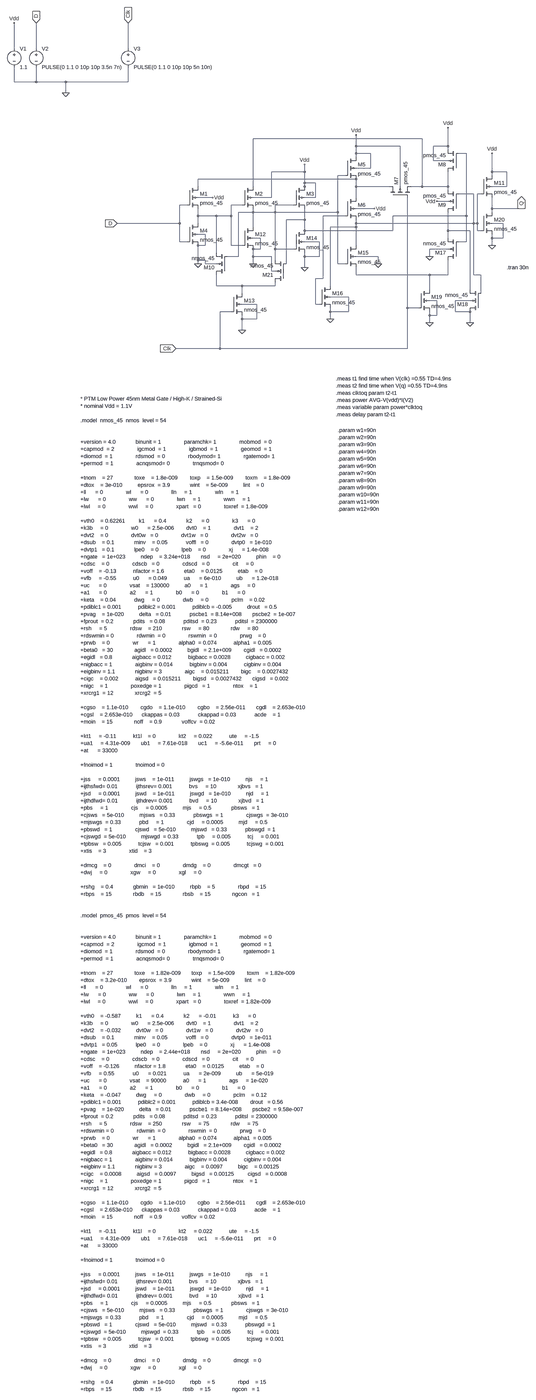
[diagram p0: schematic TCFF.asc, whole sheet]
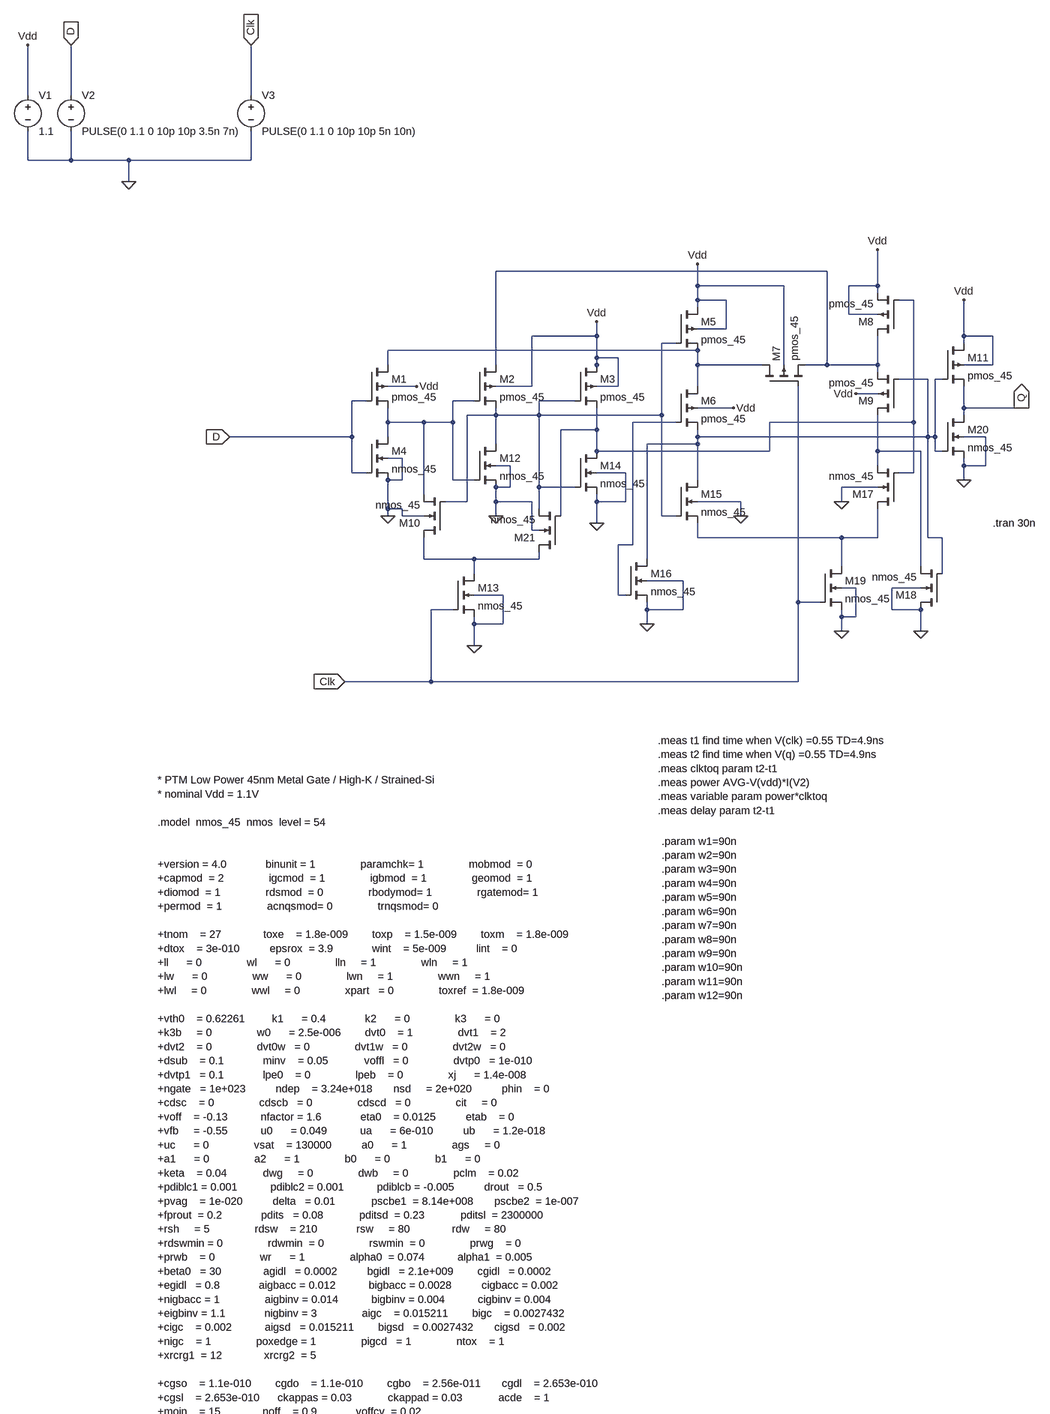
[diagram p1: schematic TCFF.asc, part, row 1 of 2, column 1 of 1]
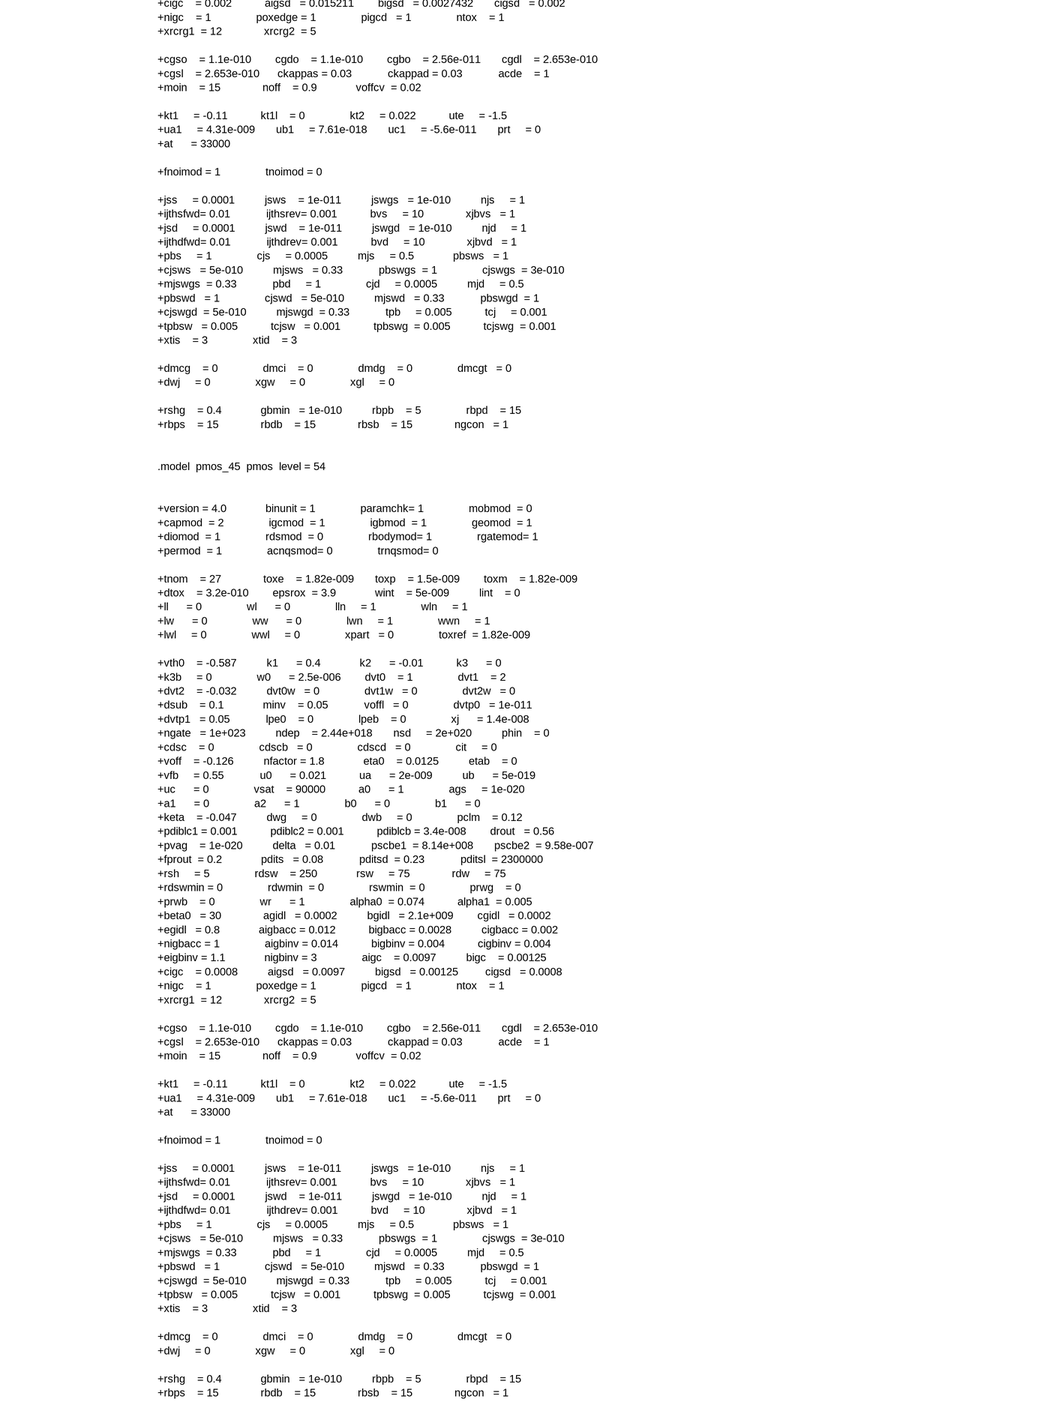
[diagram p2: schematic TCFF.asc, part, row 2 of 2, column 1 of 1]
TCFF.asc, the LTspice schematic file:
Version 4
SHEET 1 1628 4944
WIRE -656 -768 -656 -880
WIRE -560 -768 -560 -880
WIRE -160 -768 -160 -880
WIRE -656 -624 -656 -688
WIRE -560 -624 -560 -688
WIRE -560 -624 -656 -624
WIRE -432 -624 -560 -624
WIRE -160 -624 -160 -688
WIRE -160 -624 -432 -624
WIRE -432 -576 -432 -624
WIRE 1120 -112 384 -112
WIRE 832 -80 832 -128
WIRE 1024 -80 832 -80
WIRE 1232 -80 1232 -160
WIRE 1232 -80 1168 -80
WIRE 1232 -64 1232 -80
WIRE 832 -48 832 -80
WIRE 896 -48 832 -48
WIRE 1312 -48 1280 -48
WIRE 832 -32 832 -48
WIRE 1168 -16 1168 -80
WIRE 1232 -16 1168 -16
WIRE 896 16 896 -48
WIRE 896 16 832 16
WIRE 608 32 608 0
WIRE 608 32 464 32
WIRE 1424 32 1424 -48
WIRE 1488 32 1424 32
WIRE 784 48 752 48
WIRE 1424 48 1424 32
WIRE 832 64 144 64
WIRE 608 80 608 32
WIRE 656 80 608 80
WIRE 144 96 144 64
WIRE 384 96 384 -112
WIRE 608 96 608 80
WIRE 832 96 832 64
WIRE 976 96 832 96
WIRE 1024 96 1024 -80
WIRE 1120 96 1120 -112
WIRE 1120 96 1072 96
WIRE 1232 96 1232 32
WIRE 1232 96 1120 96
WIRE 1488 96 1488 32
WIRE 1488 96 1424 96
WIRE 608 112 608 96
WIRE 1232 112 1232 96
WIRE 1344 128 1280 128
WIRE 1376 128 1360 128
WIRE 208 144 144 144
WIRE 464 144 464 32
WIRE 464 144 384 144
WIRE 656 144 656 80
WIRE 656 144 608 144
WIRE 832 144 832 96
WIRE 1232 160 1184 160
WIRE 96 176 64 176
WIRE 336 176 288 176
WIRE 560 176 480 176
WIRE 912 192 832 192
WIRE 1424 192 1424 144
WIRE 1552 192 1424 192
WIRE 1568 192 1552 192
WIRE 384 208 384 192
WIRE 384 208 320 208
WIRE 480 208 480 176
WIRE 480 208 384 208
WIRE 752 208 752 48
WIRE 752 208 480 208
WIRE 1424 208 1424 192
WIRE 144 224 144 192
WIRE 224 224 144 224
WIRE 288 224 288 176
WIRE 288 224 224 224
WIRE 784 224 688 224
WIRE 1312 224 1312 -48
WIRE 1312 224 992 224
WIRE 608 240 608 192
WIRE 608 240 528 240
WIRE 64 256 64 176
WIRE 64 256 -208 256
WIRE 144 256 144 224
WIRE 832 256 832 240
WIRE 1344 256 1344 128
WIRE 1344 256 832 256
WIRE 1360 256 1360 128
WIRE 1360 256 1344 256
WIRE 1472 256 1424 256
WIRE 384 272 384 208
WIRE 832 272 832 256
WIRE 832 272 720 272
WIRE 608 288 608 240
WIRE 992 288 992 224
WIRE 992 288 608 288
WIRE 1232 288 1232 208
WIRE 1328 288 1232 288
WIRE 1360 288 1360 256
WIRE 1376 288 1360 288
WIRE 176 304 144 304
WIRE 416 320 384 320
WIRE 1232 320 1232 288
WIRE 1424 320 1424 304
WIRE 1472 320 1472 256
WIRE 1472 320 1424 320
WIRE 64 336 64 256
WIRE 96 336 64 336
WIRE 672 336 608 336
WIRE 1312 336 1312 224
WIRE 1312 336 1280 336
WIRE 176 352 176 304
WIRE 176 352 144 352
WIRE 288 352 288 224
WIRE 336 352 288 352
WIRE 832 352 832 272
WIRE 1424 352 1424 320
WIRE 416 368 416 320
WIRE 416 368 384 368
WIRE 480 368 480 208
WIRE 560 368 480 368
WIRE 1232 368 1152 368
WIRE 224 384 224 224
WIRE 320 400 320 208
WIRE 320 400 272 400
WIRE 384 400 384 368
WIRE 464 400 384 400
WIRE 608 400 608 384
WIRE 672 400 672 336
WIRE 672 400 608 400
WIRE 928 400 832 400
WIRE 1152 400 1152 368
WIRE 144 416 144 352
WIRE 176 416 144 416
WIRE 480 416 480 368
WIRE 144 432 144 416
WIRE 176 432 176 416
WIRE 224 432 176 432
WIRE 384 432 384 400
WIRE 528 432 528 240
WIRE 752 432 752 208
WIRE 784 432 752 432
WIRE 928 432 928 400
WIRE 608 448 608 400
WIRE 464 464 464 400
WIRE 480 464 464 464
WIRE 832 480 832 448
WIRE 1152 480 832 480
WIRE 1232 480 1232 416
WIRE 1232 480 1152 480
WIRE 1344 480 1344 256
WIRE 1376 480 1344 480
WIRE 688 496 688 224
WIRE 688 496 656 496
WIRE 224 528 224 480
WIRE 336 528 224 528
WIRE 480 528 480 512
WIRE 480 528 336 528
WIRE 720 528 720 272
WIRE 1152 544 1152 480
WIRE 1328 544 1328 288
WIRE 336 560 336 528
WIRE 1376 560 1376 480
WIRE 800 576 720 576
WIRE 1184 592 1152 592
WIRE 1328 592 1264 592
WIRE 400 608 336 608
WIRE 656 608 656 496
WIRE 672 608 656 608
WIRE 1056 624 1056 144
WIRE 1104 624 1056 624
WIRE 288 640 240 640
WIRE 720 640 720 624
WIRE 800 640 800 576
WIRE 800 640 720 640
WIRE 1264 640 1264 592
WIRE 1328 640 1264 640
WIRE 1152 656 1152 640
WIRE 1184 656 1184 592
WIRE 1184 656 1152 656
WIRE 336 672 336 656
WIRE 400 672 400 608
WIRE 400 672 336 672
WIRE 720 672 720 640
WIRE 1152 688 1152 656
WIRE 1328 688 1328 640
WIRE 336 720 336 672
WIRE 240 800 240 640
WIRE 240 800 48 800
WIRE 1056 800 1056 624
WIRE 1056 800 240 800
FLAG -560 -880 D
IOPIN -560 -880 In
FLAG -160 -880 Clk
IOPIN -160 -880 In
FLAG -656 -880 Vdd
FLAG -432 -576 0
FLAG 1424 352 0
FLAG 1328 688 0
FLAG 1152 688 0
FLAG 720 672 0
FLAG 336 720 0
FLAG 608 448 0
FLAG 384 432 0
FLAG 144 432 0
FLAG 48 800 Clk
IOPIN 48 800 In
FLAG -208 256 D
IOPIN -208 256 In
FLAG 608 0 Vdd
FLAG 832 -128 Vdd
FLAG 1232 -160 Vdd
FLAG 1424 -48 Vdd
FLAG 1184 160 Vdd
FLAG 1152 400 0
FLAG 208 144 Vdd
FLAG 912 192 Vdd
FLAG 928 432 0
FLAG 1552 192 Q
IOPIN 1552 192 Out
SYMBOL pmos4 96 96 R0
SYMATTR InstName M1
SYMATTR Value pmos_45
SYMATTR Value2 l=45n w=180n
SYMBOL pmos4 336 96 R0
SYMATTR InstName M2
SYMATTR Value pmos_45
SYMATTR Value2 l=45n w=180n
SYMBOL pmos4 560 96 R0
SYMATTR InstName M3
SYMATTR Value pmos_45
SYMATTR Value2 l=45n w=180n
SYMBOL pmos4 784 -32 R0
SYMATTR InstName M5
SYMATTR Value pmos_45
SYMATTR Value2 l=45n w=180n
SYMBOL pmos4 784 144 R0
SYMATTR InstName M6
SYMATTR Value pmos_45
SYMATTR Value2 l=45n w=180n
SYMBOL pmos4 976 144 R270
SYMATTR InstName M7
SYMATTR Value pmos_45
SYMATTR Value2 l=45n w=180n
SYMBOL pmos4 1280 32 R180
SYMATTR InstName M8
SYMATTR Value pmos_45
SYMATTR Value2 l=45n w=180n
SYMBOL pmos4 1280 208 R180
SYMATTR InstName M9
SYMATTR Value pmos_45
SYMATTR Value2 l=45n w=180n
SYMBOL pmos4 1376 48 R0
SYMATTR InstName M11
SYMATTR Value pmos_45
SYMATTR Value2 l=45n w=180n
SYMBOL nmos4 96 256 R0
SYMATTR InstName M4
SYMATTR Value nmos_45
SYMATTR Value2 l=45n w={w1}
SYMBOL nmos4 272 480 R180
SYMATTR InstName M10
SYMATTR Value nmos_45
SYMATTR Value2 l=45n w={w2}
SYMBOL nmos4 336 272 R0
SYMATTR InstName M12
SYMATTR Value nmos_45
SYMATTR Value2 l=45n w={w4}
SYMBOL nmos4 288 560 R0
SYMATTR InstName M13
SYMATTR Value nmos_45
SYMATTR Value2 l=45n w={w3}
SYMBOL nmos4 560 288 R0
SYMATTR InstName M14
SYMATTR Value nmos_45
SYMATTR Value2 l=45n w={w6}
SYMBOL nmos4 784 352 R0
SYMATTR InstName M15
SYMATTR Value nmos_45
SYMATTR Value2 l=45n w={w7}
SYMBOL nmos4 672 528 R0
SYMATTR InstName M16
SYMATTR Value nmos_45
SYMATTR Value2 l=45n w={w8}
SYMBOL nmos4 1280 416 R180
SYMATTR InstName M17
SYMATTR Value nmos_45
SYMATTR Value2 l=45n w={w9}
SYMBOL nmos4 1376 640 R180
SYMATTR InstName M18
SYMATTR Value nmos_45
SYMATTR Value2 l=45n w={w11}
SYMBOL nmos4 1104 544 R0
SYMATTR InstName M19
SYMATTR Value nmos_45
SYMATTR Value2 l=45n w={w10}
SYMBOL nmos4 1376 208 R0
SYMATTR InstName M20
SYMATTR Value nmos_45
SYMATTR Value2 l=45n w={w12}
SYMBOL voltage -656 -784 R0
WINDOW 123 0 0 Left 0
WINDOW 39 0 0 Left 0
SYMATTR InstName V1
SYMATTR Value 1.1
SYMBOL voltage -560 -784 R0
WINDOW 123 0 0 Left 0
WINDOW 39 0 0 Left 0
SYMATTR InstName V2
SYMATTR Value PULSE(0 1.1 0 10p 10p 3.5n 7n)
SYMBOL voltage -160 -784 R0
WINDOW 123 0 0 Left 0
WINDOW 39 0 0 Left 0
SYMATTR InstName V3
SYMATTR Value PULSE(0 1.1 0 10p 10p 5n 10n)
SYMBOL nmos4 528 512 R180
SYMATTR InstName M21
SYMATTR Value nmos_45
SYMATTR Value2 l=45n w={w5}
TEXT 1488 448 Left 2 !.tran 30n
TEXT -368 1064 Left 2 !* PTM Low Power 45nm Metal Gate / High-K / Strained-Si\n* nominal Vdd = 1.1V\n \n.model  nmos_45  nmos  level = 54\n \n \n+version = 4.0             binunit = 1               paramchk= 1               mobmod  = 0             \n+capmod  = 2               igcmod  = 1               igbmod  = 1               geomod  = 1             \n+diomod  = 1               rdsmod  = 0               rbodymod= 1               rgatemod= 1             \n+permod  = 1               acnqsmod= 0               trnqsmod= 0             \n \n+tnom    = 27              toxe    = 1.8e-009        toxp    = 1.5e-009        toxm    = 1.8e-009      \n+dtox    = 3e-010          epsrox  = 3.9             wint    = 5e-009          lint    = 0             \n+ll      = 0               wl      = 0               lln     = 1               wln     = 1             \n+lw      = 0               ww      = 0               lwn     = 1               wwn     = 1             \n+lwl     = 0               wwl     = 0               xpart   = 0               toxref  = 1.8e-009      \n \n+vth0    = 0.62261         k1      = 0.4             k2      = 0               k3      = 0             \n+k3b     = 0               w0      = 2.5e-006        dvt0    = 1               dvt1    = 2             \n+dvt2    = 0               dvt0w   = 0               dvt1w   = 0               dvt2w   = 0             \n+dsub    = 0.1             minv    = 0.05            voffl   = 0               dvtp0   = 1e-010        \n+dvtp1   = 0.1             lpe0    = 0               lpeb    = 0               xj      = 1.4e-008      \n+ngate   = 1e+023          ndep    = 3.24e+018       nsd     = 2e+020          phin    = 0             \n+cdsc    = 0               cdscb   = 0               cdscd   = 0               cit     = 0             \n+voff    = -0.13           nfactor = 1.6             eta0    = 0.0125          etab    = 0             \n+vfb     = -0.55           u0      = 0.049           ua      = 6e-010          ub      = 1.2e-018      \n+uc      = 0               vsat    = 130000          a0      = 1               ags     = 0             \n+a1      = 0               a2      = 1               b0      = 0               b1      = 0             \n+keta    = 0.04            dwg     = 0               dwb     = 0               pclm    = 0.02          \n+pdiblc1 = 0.001           pdiblc2 = 0.001           pdiblcb = -0.005          drout   = 0.5           \n+pvag    = 1e-020          delta   = 0.01            pscbe1  = 8.14e+008       pscbe2  = 1e-007        \n+fprout  = 0.2             pdits   = 0.08            pditsd  = 0.23            pditsl  = 2300000       \n+rsh     = 5               rdsw    = 210             rsw     = 80              rdw     = 80            \n+rdswmin = 0               rdwmin  = 0               rswmin  = 0               prwg    = 0             \n+prwb    = 0               wr      = 1               alpha0  = 0.074           alpha1  = 0.005         \n+beta0   = 30              agidl   = 0.0002          bgidl   = 2.1e+009        cgidl   = 0.0002        \n+egidl   = 0.8             aigbacc = 0.012           bigbacc = 0.0028          cigbacc = 0.002         \n+nigbacc = 1               aigbinv = 0.014           bigbinv = 0.004           cigbinv = 0.004         \n+eigbinv = 1.1             nigbinv = 3               aigc    = 0.015211        bigc    = 0.0027432     \n+cigc    = 0.002           aigsd   = 0.015211        bigsd   = 0.0027432       cigsd   = 0.002         \n+nigc    = 1               poxedge = 1               pigcd   = 1               ntox    = 1             \n+xrcrg1  = 12              xrcrg2  = 5             \n \n+cgso    = 1.1e-010        cgdo    = 1.1e-010        cgbo    = 2.56e-011       cgdl    = 2.653e-010    \n+cgsl    = 2.653e-010      ckappas = 0.03            ckappad = 0.03            acde    = 1             \n+moin    = 15              noff    = 0.9             voffcv  = 0.02          \n \n+kt1     = -0.11           kt1l    = 0               kt2     = 0.022           ute     = -1.5          \n+ua1     = 4.31e-009       ub1     = 7.61e-018       uc1     = -5.6e-011       prt     = 0             \n+at      = 33000         \n \n+fnoimod = 1               tnoimod = 0             \n \n+jss     = 0.0001          jsws    = 1e-011          jswgs   = 1e-010          njs     = 1             \n+ijthsfwd= 0.01            ijthsrev= 0.001           bvs     = 10              xjbvs   = 1             \n+jsd     = 0.0001          jswd    = 1e-011          jswgd   = 1e-010          njd     = 1             \n+ijthdfwd= 0.01            ijthdrev= 0.001           bvd     = 10              xjbvd   = 1             \n+pbs     = 1               cjs     = 0.0005          mjs     = 0.5             pbsws   = 1             \n+cjsws   = 5e-010          mjsws   = 0.33            pbswgs  = 1               cjswgs  = 3e-010        \n+mjswgs  = 0.33            pbd     = 1               cjd     = 0.0005          mjd     = 0.5           \n+pbswd   = 1               cjswd   = 5e-010          mjswd   = 0.33            pbswgd  = 1             \n+cjswgd  = 5e-010          mjswgd  = 0.33            tpb     = 0.005           tcj     = 0.001         \n+tpbsw   = 0.005           tcjsw   = 0.001           tpbswg  = 0.005           tcjswg  = 0.001         \n+xtis    = 3               xtid    = 3             \n \n+dmcg    = 0               dmci    = 0               dmdg    = 0               dmcgt   = 0             \n+dwj     = 0               xgw     = 0               xgl     = 0             \n \n+rshg    = 0.4             gbmin   = 1e-010          rbpb    = 5               rbpd    = 15            \n+rbps    = 15              rbdb    = 15              rbsb    = 15              ngcon   = 1             \n \n \n.model  pmos_45  pmos  level = 54\n \n \n+version = 4.0             binunit = 1               paramchk= 1               mobmod  = 0             \n+capmod  = 2               igcmod  = 1               igbmod  = 1               geomod  = 1             \n+diomod  = 1               rdsmod  = 0               rbodymod= 1               rgatemod= 1             \n+permod  = 1               acnqsmod= 0               trnqsmod= 0             \n \n+tnom    = 27              toxe    = 1.82e-009       toxp    = 1.5e-009        toxm    = 1.82e-009     \n+dtox    = 3.2e-010        epsrox  = 3.9             wint    = 5e-009          lint    = 0             \n+ll      = 0               wl      = 0               lln     = 1               wln     = 1             \n+lw      = 0               ww      = 0               lwn     = 1               wwn     = 1             \n+lwl     = 0               wwl     = 0               xpart   = 0               toxref  = 1.82e-009     \n \n+vth0    = -0.587          k1      = 0.4             k2      = -0.01           k3      = 0             \n+k3b     = 0               w0      = 2.5e-006        dvt0    = 1               dvt1    = 2             \n+dvt2    = -0.032          dvt0w   = 0               dvt1w   = 0               dvt2w   = 0             \n+dsub    = 0.1             minv    = 0.05            voffl   = 0               dvtp0   = 1e-011        \n+dvtp1   = 0.05            lpe0    = 0               lpeb    = 0               xj      = 1.4e-008      \n+ngate   = 1e+023          ndep    = 2.44e+018       nsd     = 2e+020          phin    = 0             \n+cdsc    = 0               cdscb   = 0               cdscd   = 0               cit     = 0             \n+voff    = -0.126          nfactor = 1.8             eta0    = 0.0125          etab    = 0             \n+vfb     = 0.55            u0      = 0.021           ua      = 2e-009          ub      = 5e-019        \n+uc      = 0               vsat    = 90000           a0      = 1               ags     = 1e-020        \n+a1      = 0               a2      = 1               b0      = 0               b1      = 0             \n+keta    = -0.047          dwg     = 0               dwb     = 0               pclm    = 0.12          \n+pdiblc1 = 0.001           pdiblc2 = 0.001           pdiblcb = 3.4e-008        drout   = 0.56          \n+pvag    = 1e-020          delta   = 0.01            pscbe1  = 8.14e+008       pscbe2  = 9.58e-007     \n+fprout  = 0.2             pdits   = 0.08            pditsd  = 0.23            pditsl  = 2300000       \n+rsh     = 5               rdsw    = 250             rsw     = 75              rdw     = 75            \n+rdswmin = 0               rdwmin  = 0               rswmin  = 0               prwg    = 0             \n+prwb    = 0               wr      = 1               alpha0  = 0.074           alpha1  = 0.005         \n+beta0   = 30              agidl   = 0.0002          bgidl   = 2.1e+009        cgidl   = 0.0002        \n+egidl   = 0.8             aigbacc = 0.012           bigbacc = 0.0028          cigbacc = 0.002         \n+nigbacc = 1               aigbinv = 0.014           bigbinv = 0.004           cigbinv = 0.004         \n+eigbinv = 1.1             nigbinv = 3               aigc    = 0.0097          bigc    = 0.00125       \n+cigc    = 0.0008          aigsd   = 0.0097          bigsd   = 0.00125         cigsd   = 0.0008        \n+nigc    = 1               poxedge = 1               pigcd   = 1               ntox    = 1             \n+xrcrg1  = 12              xrcrg2  = 5             \n \n+cgso    = 1.1e-010        cgdo    = 1.1e-010        cgbo    = 2.56e-011       cgdl    = 2.653e-010    \n+cgsl    = 2.653e-010      ckappas = 0.03            ckappad = 0.03            acde    = 1             \n+moin    = 15              noff    = 0.9             voffcv  = 0.02          \n \n+kt1     = -0.11           kt1l    = 0               kt2     = 0.022           ute     = -1.5          \n+ua1     = 4.31e-009       ub1     = 7.61e-018       uc1     = -5.6e-011       prt     = 0             \n+at      = 33000         \n \n+fnoimod = 1               tnoimod = 0             \n \n+jss     = 0.0001          jsws    = 1e-011          jswgs   = 1e-010          njs     = 1             \n+ijthsfwd= 0.01            ijthsrev= 0.001           bvs     = 10              xjbvs   = 1             \n+jsd     = 0.0001          jswd    = 1e-011          jswgd   = 1e-010          njd     = 1             \n+ijthdfwd= 0.01            ijthdrev= 0.001           bvd     = 10              xjbvd   = 1             \n+pbs     = 1               cjs     = 0.0005          mjs     = 0.5             pbsws   = 1             \n+cjsws   = 5e-010          mjsws   = 0.33            pbswgs  = 1               cjswgs  = 3e-010        \n+mjswgs  = 0.33            pbd     = 1               cjd     = 0.0005          mjd     = 0.5           \n+pbswd   = 1               cjswd   = 5e-010          mjswd   = 0.33            pbswgd  = 1             \n+cjswgd  = 5e-010          mjswgd  = 0.33            tpb     = 0.005           tcj     = 0.001         \n+tpbsw   = 0.005           tcjsw   = 0.001           tpbswg  = 0.005           tcjswg  = 0.001         \n+xtis    = 3               xtid    = 3             \n \n+dmcg    = 0               dmci    = 0               dmdg    = 0               dmcgt   = 0             \n+dwj     = 0               xgw     = 0               xgl     = 0             \n \n+rshg    = 0.4             gbmin   = 1e-010          rbpb    = 5               rbpd    = 15            \n+rbps    = 15              rbdb    = 15              rbsb    = 15              ngcon   = 1
TEXT 744 976 Left 2 !.meas t1 find time when V(clk) =0.55 TD=4.9ns\n.meas t2 find time when V(q) =0.55 TD=4.9ns\n.meas clktoq param t2-t1\n.meas power AVG-V(vdd)*I(V2)\n.meas variable param power*clktoq\n.meas delay param t2-t1
TEXT 752 1200 Left 2 !.param w1=90n \n.param w2=90n\n.param w3=90n\n.param w4=90n\n.param w5=90n\n.param w6=90n \n.param w7=90n\n.param w8=90n\n.param w9=90n\n.param w10=90n\n.param w11=90n\n.param w12=90n

The netlist it stands for:
* TCFF.asc
M1 N004 D N006 Vdd pmos_45 l=45n w=180n
M2 N001 N006 N003 Vdd pmos_45 l=45n w=180n
M3 Vdd N003 N002 Vdd pmos_45 l=45n w=180n
M5 Vdd N003 N004 Vdd pmos_45 l=45n w=180n
M6 N004 N007 N005 Vdd pmos_45 l=45n w=180n
M7 N004 Clk N001 Vdd pmos_45 l=45n w=180n
M8 N001 N002 Vdd Vdd pmos_45 l=45n w=180n
M9 N008 N005 N001 Vdd pmos_45 l=45n w=180n
M11 Vdd N005 Q Vdd pmos_45 l=45n w=180n
M4 N006 D 0 0 nmos_45 l=45n w={w1}
M10 N010 N003 N006 0 nmos_45 l=45n w={w2}
M12 N003 N006 0 0 nmos_45 l=45n w={w4}
M13 N010 Clk 0 0 nmos_45 l=45n w={w3}
M14 N002 N003 0 0 nmos_45 l=45n w={w6}
M15 N005 N003 N009 0 nmos_45 l=45n w={w7}
M16 N005 N007 0 0 nmos_45 l=45n w={w8}
M17 N009 N002 N008 0 nmos_45 l=45n w={w9}
M18 0 N005 N008 0 nmos_45 l=45n w={w11}
M19 N009 Clk 0 0 nmos_45 l=45n w={w10}
M20 Q N005 0 0 nmos_45 l=45n w={w12}
V1 Vdd 0 1.1
V2 D 0 PULSE(0 1.1 0 10p 10p 3.5n 7n)
V3 Clk 0 PULSE(0 1.1 0 10p 10p 5n 10n)
M21 N010 N002 N003 0 nmos_45 l=45n w={w5}
.model NMOS NMOS
.model PMOS PMOS
.lib standard.mos
.tran 30n
* PTM Low Power 45nm Metal Gate / High-K / Strained-Si
* nominal Vdd = 1.1V
.model  nmos_45  nmos  level = 54
+version = 4.0             binunit = 1               paramchk= 1               mobmod  = 0
+capmod  = 2               igcmod  = 1               igbmod  = 1               geomod  = 1
+diomod  = 1               rdsmod  = 0               rbodymod= 1               rgatemod= 1
+permod  = 1               acnqsmod= 0               trnqsmod= 0
+tnom    = 27              toxe    = 1.8e-009        toxp    = 1.5e-009        toxm    = 1.8e-009
+dtox    = 3e-010          epsrox  = 3.9             wint    = 5e-009          lint    = 0
+ll      = 0               wl      = 0               lln     = 1               wln     = 1
+lw      = 0               ww      = 0               lwn     = 1               wwn     = 1
+lwl     = 0               wwl     = 0               xpart   = 0               toxref  = 1.8e-009
+vth0    = 0.62261         k1      = 0.4             k2      = 0               k3      = 0
+k3b     = 0               w0      = 2.5e-006        dvt0    = 1               dvt1    = 2
+dvt2    = 0               dvt0w   = 0               dvt1w   = 0               dvt2w   = 0
+dsub    = 0.1             minv    = 0.05            voffl   = 0               dvtp0   = 1e-010
+dvtp1   = 0.1             lpe0    = 0               lpeb    = 0               xj      = 1.4e-008
+ngate   = 1e+023          ndep    = 3.24e+018       nsd     = 2e+020          phin    = 0
+cdsc    = 0               cdscb   = 0               cdscd   = 0               cit     = 0
+voff    = -0.13           nfactor = 1.6             eta0    = 0.0125          etab    = 0
+vfb     = -0.55           u0      = 0.049           ua      = 6e-010          ub      = 1.2e-018
+uc      = 0               vsat    = 130000          a0      = 1               ags     = 0
+a1      = 0               a2      = 1               b0      = 0               b1      = 0
+keta    = 0.04            dwg     = 0               dwb     = 0               pclm    = 0.02
+pdiblc1 = 0.001           pdiblc2 = 0.001           pdiblcb = -0.005          drout   = 0.5
+pvag    = 1e-020          delta   = 0.01            pscbe1  = 8.14e+008       pscbe2  = 1e-007
+fprout  = 0.2             pdits   = 0.08            pditsd  = 0.23            pditsl  = 2300000
+rsh     = 5               rdsw    = 210             rsw     = 80              rdw     = 80
+rdswmin = 0               rdwmin  = 0               rswmin  = 0               prwg    = 0
+prwb    = 0               wr      = 1               alpha0  = 0.074           alpha1  = 0.005
+beta0   = 30              agidl   = 0.0002          bgidl   = 2.1e+009        cgidl   = 0.0002
+egidl   = 0.8             aigbacc = 0.012           bigbacc = 0.0028          cigbacc = 0.002
+nigbacc = 1               aigbinv = 0.014           bigbinv = 0.004           cigbinv = 0.004
+eigbinv = 1.1             nigbinv = 3               aigc    = 0.015211        bigc    = 0.0027432
+cigc    = 0.002           aigsd   = 0.015211        bigsd   = 0.0027432       cigsd   = 0.002
+nigc    = 1               poxedge = 1               pigcd   = 1               ntox    = 1
+xrcrg1  = 12              xrcrg2  = 5
+cgso    = 1.1e-010        cgdo    = 1.1e-010        cgbo    = 2.56e-011       cgdl    = 2.653e-010
+cgsl    = 2.653e-010      ckappas = 0.03            ckappad = 0.03            acde    = 1
+moin    = 15              noff    = 0.9             voffcv  = 0.02
+kt1     = -0.11           kt1l    = 0               kt2     = 0.022           ute     = -1.5
+ua1     = 4.31e-009       ub1     = 7.61e-018       uc1     = -5.6e-011       prt     = 0
+at      = 33000
+fnoimod = 1               tnoimod = 0
+jss     = 0.0001          jsws    = 1e-011          jswgs   = 1e-010          njs     = 1
+ijthsfwd= 0.01            ijthsrev= 0.001           bvs     = 10              xjbvs   = 1
+jsd     = 0.0001          jswd    = 1e-011          jswgd   = 1e-010          njd     = 1
+ijthdfwd= 0.01            ijthdrev= 0.001           bvd     = 10              xjbvd   = 1
+pbs     = 1               cjs     = 0.0005          mjs     = 0.5             pbsws   = 1
+cjsws   = 5e-010          mjsws   = 0.33            pbswgs  = 1               cjswgs  = 3e-010
+mjswgs  = 0.33            pbd     = 1               cjd     = 0.0005          mjd     = 0.5
+pbswd   = 1               cjswd   = 5e-010          mjswd   = 0.33            pbswgd  = 1
+cjswgd  = 5e-010          mjswgd  = 0.33            tpb     = 0.005           tcj     = 0.001
+tpbsw   = 0.005           tcjsw   = 0.001           tpbswg  = 0.005           tcjswg  = 0.001
+xtis    = 3               xtid    = 3
+dmcg    = 0               dmci    = 0               dmdg    = 0               dmcgt   = 0
+dwj     = 0               xgw     = 0               xgl     = 0
+rshg    = 0.4             gbmin   = 1e-010          rbpb    = 5               rbpd    = 15
+rbps    = 15              rbdb    = 15              rbsb    = 15              ngcon   = 1
.model  pmos_45  pmos  level = 54
+version = 4.0             binunit = 1               paramchk= 1               mobmod  = 0
+capmod  = 2               igcmod  = 1               igbmod  = 1               geomod  = 1
+diomod  = 1               rdsmod  = 0               rbodymod= 1               rgatemod= 1
+permod  = 1               acnqsmod= 0               trnqsmod= 0
+tnom    = 27              toxe    = 1.82e-009       toxp    = 1.5e-009        toxm    = 1.82e-009
+dtox    = 3.2e-010        epsrox  = 3.9             wint    = 5e-009          lint    = 0
+ll      = 0               wl      = 0               lln     = 1               wln     = 1
+lw      = 0               ww      = 0               lwn     = 1               wwn     = 1
+lwl     = 0               wwl     = 0               xpart   = 0               toxref  = 1.82e-009
+vth0    = -0.587          k1      = 0.4             k2      = -0.01           k3      = 0
+k3b     = 0               w0      = 2.5e-006        dvt0    = 1               dvt1    = 2
+dvt2    = -0.032          dvt0w   = 0               dvt1w   = 0               dvt2w   = 0
+dsub    = 0.1             minv    = 0.05            voffl   = 0               dvtp0   = 1e-011
+dvtp1   = 0.05            lpe0    = 0               lpeb    = 0               xj      = 1.4e-008
+ngate   = 1e+023          ndep    = 2.44e+018       nsd     = 2e+020          phin    = 0
+cdsc    = 0               cdscb   = 0               cdscd   = 0               cit     = 0
+voff    = -0.126          nfactor = 1.8             eta0    = 0.0125          etab    = 0
+vfb     = 0.55            u0      = 0.021           ua      = 2e-009          ub      = 5e-019
+uc      = 0               vsat    = 90000           a0      = 1               ags     = 1e-020
+a1      = 0               a2      = 1               b0      = 0               b1      = 0
+keta    = -0.047          dwg     = 0               dwb     = 0               pclm    = 0.12
+pdiblc1 = 0.001           pdiblc2 = 0.001           pdiblcb = 3.4e-008        drout   = 0.56
+pvag    = 1e-020          delta   = 0.01            pscbe1  = 8.14e+008       pscbe2  = 9.58e-007
+fprout  = 0.2             pdits   = 0.08            pditsd  = 0.23            pditsl  = 2300000
+rsh     = 5               rdsw    = 250             rsw     = 75              rdw     = 75
+rdswmin = 0               rdwmin  = 0               rswmin  = 0               prwg    = 0
+prwb    = 0               wr      = 1               alpha0  = 0.074           alpha1  = 0.005
+beta0   = 30              agidl   = 0.0002          bgidl   = 2.1e+009        cgidl   = 0.0002
+egidl   = 0.8             aigbacc = 0.012           bigbacc = 0.0028          cigbacc = 0.002
+nigbacc = 1               aigbinv = 0.014           bigbinv = 0.004           cigbinv = 0.004
+eigbinv = 1.1             nigbinv = 3               aigc    = 0.0097          bigc    = 0.00125
+cigc    = 0.0008          aigsd   = 0.0097          bigsd   = 0.00125         cigsd   = 0.0008
+nigc    = 1               poxedge = 1               pigcd   = 1               ntox    = 1
+xrcrg1  = 12              xrcrg2  = 5
+cgso    = 1.1e-010        cgdo    = 1.1e-010        cgbo    = 2.56e-011       cgdl    = 2.653e-010
+cgsl    = 2.653e-010      ckappas = 0.03            ckappad = 0.03            acde    = 1
+moin    = 15              noff    = 0.9             voffcv  = 0.02
+kt1     = -0.11           kt1l    = 0               kt2     = 0.022           ute     = -1.5
+ua1     = 4.31e-009       ub1     = 7.61e-018       uc1     = -5.6e-011       prt     = 0
+at      = 33000
+fnoimod = 1               tnoimod = 0
+jss     = 0.0001          jsws    = 1e-011          jswgs   = 1e-010          njs     = 1
+ijthsfwd= 0.01            ijthsrev= 0.001           bvs     = 10              xjbvs   = 1
+jsd     = 0.0001          jswd    = 1e-011          jswgd   = 1e-010          njd     = 1
+ijthdfwd= 0.01            ijthdrev= 0.001           bvd     = 10              xjbvd   = 1
+pbs     = 1               cjs     = 0.0005          mjs     = 0.5             pbsws   = 1
+cjsws   = 5e-010          mjsws   = 0.33            pbswgs  = 1               cjswgs  = 3e-010
+mjswgs  = 0.33            pbd     = 1               cjd     = 0.0005          mjd     = 0.5
+pbswd   = 1               cjswd   = 5e-010          mjswd   = 0.33            pbswgd  = 1
+cjswgd  = 5e-010          mjswgd  = 0.33            tpb     = 0.005           tcj     = 0.001
+tpbsw   = 0.005           tcjsw   = 0.001           tpbswg  = 0.005           tcjswg  = 0.001
+xtis    = 3               xtid    = 3
+dmcg    = 0               dmci    = 0               dmdg    = 0               dmcgt   = 0
+dwj     = 0               xgw     = 0               xgl     = 0
+rshg    = 0.4             gbmin   = 1e-010          rbpb    = 5               rbpd    = 15
+rbps    = 15              rbdb    = 15              rbsb    = 15              ngcon   = 1
.meas t1 find time when V(clk) =0.55 TD=4.9ns
.meas t2 find time when V(q) =0.55 TD=4.9ns
.meas clktoq param t2-t1
.meas power AVG-V(vdd)*I(V2)
.meas variable param power*clktoq
.meas delay param t2-t1
.param w1=90n
.param w2=90n
.param w3=90n
.param w4=90n
.param w5=90n
.param w6=90n
.param w7=90n
.param w8=90n
.param w9=90n
.param w10=90n
.param w11=90n
.param w12=90n
.backanno
.end